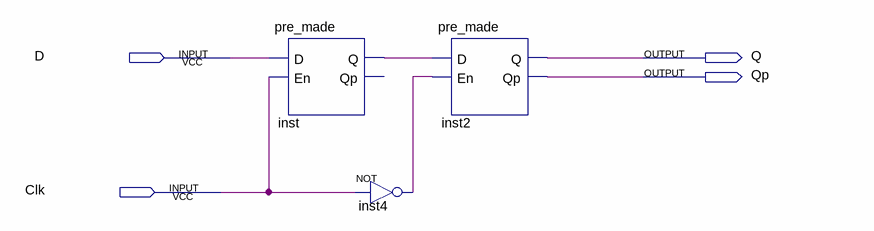
[diagram p0: schematic sheet]
// Quartus schematic EdgeD_ne.bdf as structural Verilog: 3 symbols, 4 pins
module EdgeD_ne (
  input  D,
  input  Clk,
  output Q,
  output Qp
);

  wire inst4_out, inst_q;

  pre_made inst (.D(D), .En(Clk), .Q(inst_q));  // open: Qp
  not inst4 (inst4_out, Clk);
  pre_made inst2 (.D(inst_q), .En(inst4_out), .Q(Q), .Qp(Qp));
endmodule
